# Altium schematic sheet CH32H415REU6-R0.SchDoc
size 457 x 287 mm; SheetNumber: 7; SheetTotal: 7
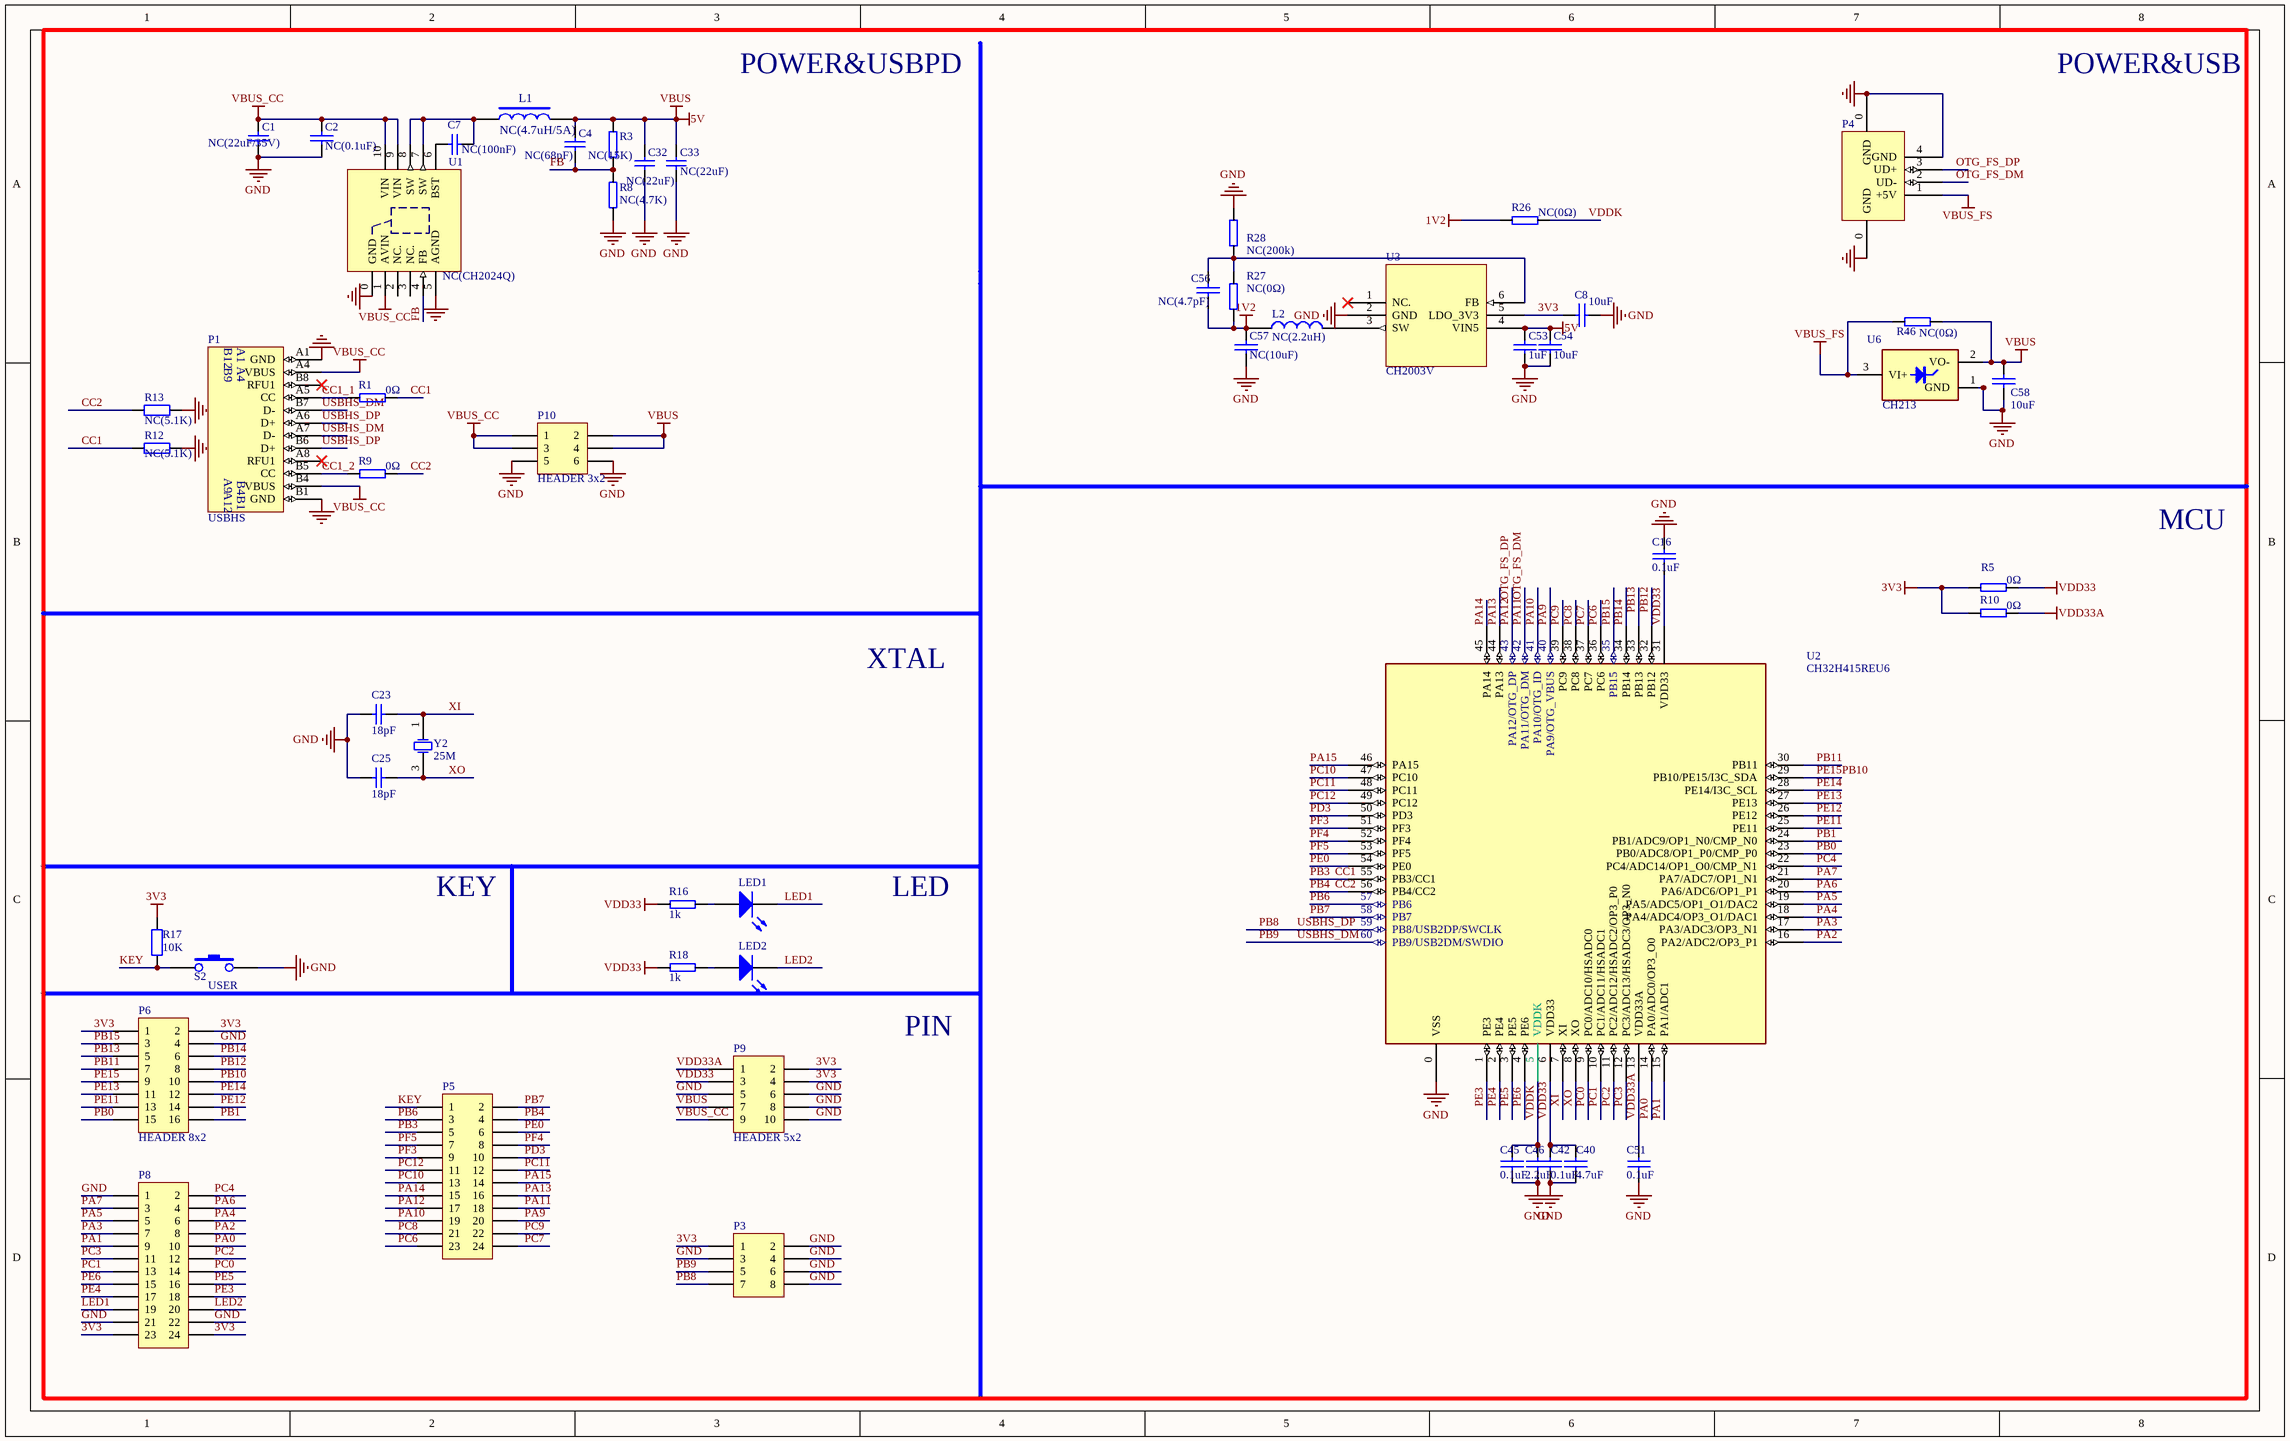
[diagram p0: CH32H415REU6-R0.SchDoc]

## Parts
C1  NC(22uF/35V)  [0805_C]
C2  NC(0.1uF)  [0402_C]
C4  NC(68pF)  [0402_C]
C7  NC(100nF)  [0603_C]
C8  10uF  [0603_C]
C16  0.1uF  [0402_C]
C23  18pF  [0402_C]
C25  18pF  [0402_C]
C32  NC(22uF)  [0805_C]
C33  NC(22uF)  [0805_C]
C40  4.7uF  [0402_C]
C42  0.1uF  [0402_C]
C45  0.1uF  [0402_C]
C46  2.2uF  [0402_C]
C51  0.1uF  [0402_C]
C53  1uF  [0402_C]
C54  10uF  [0603_C]
C56  NC(4.7pF)  [0402_C]
C57  NC(10uF)  [0603_C]
C58  10uF  [0603_C]
L1  NC(4.7uH/5A)  [SMD_6x6mm]
L2  NC(2.2uH)  [CD32]
LED1  LED2  blue  [0603+]  (value not drawn)
LED2  LED1   blue  [0603+]  (value not drawn)
P1  USBHS  [TYPE-C-Receptacle-2.0]
P3  HEADER 4x2  [IDC8-2.54mm]  (value not drawn)
P4  USB_FS  [USBAF]  (value not drawn)
P5  (no value)  [IDC24-2.54MM]
P6  HEADER 8x2  [IDC16-2.54mm]
P8  (no value)  [IDC24-2.54MM]
P9  HEADER 5x2  [IDC10-2.54mm]
P10  HEADER 3x2  [IDC6-2.54mm]
R1  0Ω  [0402]
R3  NC(15K)  [0402]
R5  0Ω  [0402]
R8  NC(4.7K)  [0402]
R9  0Ω  [0402]
R10  0Ω  [0402]
R12  NC(5.1K)  [0402]
R13  NC(5.1K)  [0402]
R16  1k  [0402]
R17  10K  [0402]
R18  1k  [0402]
R26  NC(0Ω)  [0402]
R27  NC(0Ω)  [0402]
R28  NC(200k)  [0402]
R46  NC(0Ω)  [0402]
S2  USER  [SMD_6.1x3.65x2.5mm-KEY]
U1  NC(CH2024Q)  [DFN10_3X3]
U2  CH32H415REU6  [QFN60_6X6]
U3  CH2003V  [SOT-23-6]
U6  CH213  [SOT-23-3]
Y2  25M  [XT3225]

## Nets
1V2: C56.1 C57.2 L2.2 R26.2 R27.1
3V3: C8.2 P3.1 P6.1 P6.2 P8.23 P8.24 P9.2 P9.4 R5.2 R10.2 R17.1 U3.5(LDO_3V3)
GND: C1.1 C2.1 C8.1 C16.2 C23.1 C25.1 C32.1 C33.1 C40.1 C42.1 C45.1 C46.2 C51.1 C53.1 C54.1 C57.1 C58.2 P1.A1(GND) P1.B1(GND) P3.2 P3.3 P3.4 P3.6 P3.8 P4.0(GND) P4.4(GND) P6.4 P8.1 P8.21 P8.22 P9.5 P9.6 P9.8 P9.10 P10.5 P10.6 R8.1 R12.2 R13.2 R28.2 S2.2 U1.0(GND) U1.5(AGND) U2.0(VSS) U3.2(GND) U6.1(GND)
VBUS: C4.1 C32.2 C33.2 C53.2 C54.2 C58.1 L1.2 P9.7 P10.2 P10.4 R3.2 R46.1 U3.4(VIN5) U6.2(VO-)  [also labelled 5V]
VBUS_CC: C1.2 C2.2 P1.A4(VBUS) P1.B4(VBUS) P9.9 P10.1 P10.3 U1.1(AVIN) U1.9(VIN) U1.10(VIN)
VBUS_FS: P4.1(+5V) R46.2 U6.3(VI+)
VDD33: C16.1 C40.2 C42.2 P9.3 R5.1 R16.1 R18.1 U2.6(VDD33) U2.31(VDD33)
VDD33A: C51.2 P9.1 R10.1 U2.13(VDD33A)
CC1: P5.5 R1.1 R12.1 U2.55(PB3/CC1)  [also labelled PB3]
CC1_1: P1.A5(CC) R1.2
CC1_2: P1.B5(CC) R9.2
CC2: P5.4 R9.1 R13.1 U2.56(PB4/CC2)  [also labelled PB4]
FB: C4.2 R3.1 R8.2 U1.4(FB)
KEY: P5.1 R17.2 S2.1
LED1: LED1.2(K) P8.19
LED2: LED2.2(K) P8.20
OTG_FS_DM: P4.2(UD-) P5.18 U2.42(PA11/OTG_DM)  [also labelled PA11]
OTG_FS_DP: P4.3(UD+) P5.17 U2.43(PA12/OTG_DP)  [also labelled PA12]
PA0: P8.10 U2.14(PA0/ADC0/OP3_O0)
PA1: P8.9 U2.15(PA1/ADC1)
PA2: P8.8 U2.16(PA2/ADC2/OP3_P1)
PA3: P8.7 U2.17(PA3/ADC3/OP3_N1)
PA4: P8.6 U2.18(PA4/ADC4/OP3_O1/DAC1)
PA5: P8.5 U2.19(PA5/ADC5/OP1_O1/DAC2)
PA6: P8.4 U2.20(PA6/ADC6/OP1_P1)
PA7: P8.3 U2.21(PA7/ADC7/OP1_N1)
PA9: P5.20 U2.40(PA9/OTG_VBUS)
PA10: P5.19 U2.41(PA10/OTG_ID)
PA13: P5.16 U2.44(PA13)
PA14: P5.15 U2.45(PA14)
PA15: P5.14 U2.46(PA15)
PB0: P6.15 U2.23(PB0/ADC8/OP1_P0/CMP_P0)
PB1: P6.16 U2.24(PB1/ADC9/OP1_N0/CMP_N0)
PB6: P5.3 U2.57(PB6)
PB7: P5.2 U2.58(PB7)
PB8: P1.A6(D+) P1.B6(D+) P3.7 U2.59(PB8/USB2DP/SWCLK)  [also labelled USBHS_DP]
PB9: P1.A7(D-) P1.B7(D-) P3.5 U2.60(PB9/USB2DM/SWDIO)  [also labelled USBHS_DM]
PB10: P6.9 P6.10 U2.29(PB10/PE15/I3C_SDA)  [also labelled PE15]
PB11: P6.7 U2.30(PB11)
PB12: P6.8 U2.32(PB12)
PB13: P6.5 U2.33(PB13)
PB14: P6.6 U2.34(PB14)
PB15: P6.3 U2.35(PB15)
PC0: P8.14 U2.9(PC0/ADC10/HSADC0)
PC1: P8.13 U2.10(PC1/ADC11/HSADC1)
PC2: P8.12 U2.11(PC2/ADC12/HSADC2/OP3_P0)
PC3: P8.11 U2.12(PC3/ADC13/HSADC3/OP3_N0)
PC4: P8.2 U2.22(PC4/ADC14/OP1_O0/CMP_N1)
PC6: P5.23 U2.36(PC6)
PC7: P5.24 U2.37(PC7)
PC8: P5.21 U2.38(PC8)
PC9: P5.22 U2.39(PC9)
PC10: P5.13 U2.47(PC10)
PC11: P5.12 U2.48(PC11)
PC12: P5.11 U2.49(PC12)
PD3: P5.10 U2.50(PD3)
PE0: P5.6 U2.54(PE0)
PE3: P8.18 U2.1(PE3)
PE4: P8.17 U2.2(PE4)
PE5: P8.16 U2.3(PE5)
PE6: P8.15 U2.4(PE6)
PE11: P6.13 U2.25(PE11)
PE12: P6.14 U2.26(PE12)
PE13: P6.11 U2.27(PE13)
PE14: P6.12 U2.28(PE14/I3C_SCL)
PF3: P5.9 U2.51(PF3)
PF4: P5.8 U2.52(PF4)
PF5: P5.7 U2.53(PF5)
VDDK: C45.2 C46.1 R26.1 U2.5(VDDK)
XI: C23.2 U2.7(XI) Y2.1(OSC1)
XO: C25.2 U2.8(XO) Y2.3(OSC2)
NetC7_1: C7.1 U1.6(BST)
NetC7_2: C7.2 L1.1 U1.7(SW) U1.8(SW)
NetC56_2: C56.2 R27.2 R28.1 U3.6(FB)
NetL2_1: L2.1 U3.3(SW)
NetLED1_1: LED1.1(A) R16.2
NetLED2_1: LED2.1(A) R18.2

Not connected (* = marked no-connect by the designer): P1 A8(RFU1)* B8(RFU1)*; U1 2(NC.) 3(NC.); U3 1(NC.)*

## Notes on the sheet
- POWER&USBPD
- POWER&USB
- MCU
- XTAL
- KEY
- LED
- PIN
- Title
- Size:
- Date:
- A3
- Number:
- Time:
- Revision:
- Sheet
- of
- File:
- (in symbol TYPE-C1) B12; B9; A9; A12

## Library data of the parts
C1 C4 C32 C33 = 0603 100nF (104) 10% 50V: 贴片电容; ComponentLink1Description: 供应商链接; ComponentLink1URL: http://www.szlcsc.com/product/details_15331.html; Package: 0603; Supplier: LC; SuppliersPartNumber: C14663
C2 C8 C16 C40 C42 C45 C46 C51 C53 C54 C56-C58 = CAP: Capacitor
C7 = 0603 1uF (105) 10% 50V: 贴片电容; ComponentLink1Description: 供应商链接; ComponentLink1URL: http://www.szlcsc.com/product/details_16531.html; Package: 0603; Supplier: LC; SuppliersPartNumber: C15849
C23 C25 = Cap: Capacitor
L1 L2 = INDUCTOR
LED1 LED2 = LED0: Typical INFRARED GaAs LED; Published: 8-Jun-2000; LatestRevisionDate: 08-Jul-2005; LatestRevisionNote: Mech Layer 1 removed.; PackageReference: LED-0; Publisher: Altium Limited
P1 = TYPE-C1
P3 = HEADER 4x2: Header, 4-Pin, Dual row
P4 = USB: USB Port
P5 P8 = HEADER 12x2: Header, 12-Pin, Dual row
P6 = HEADER 8x2: Header, 8-Pin, Dual row
P9 = HEADER 5x2: Header, 5-Pin, Dual row
P10 = HEADER 3x2: Header, 3-Pin, Dual row
R1 R3 R5 R8-R10 R16 R18 R26-R28 R46 = RES
R12 R13 R17 = Res2: Resistor
S2 = KEY1
U1 = CH2024Q: Step-Down DC-DC Converter, 28V input, FB 1.2V, 3A output
U2 = CH32H415REU6: RISC-V FPU HD-MCU, 400MHz, USB2.0 & PD, OPA, ADC, DAC
U3 = CH2003K: Step-Down DC-DC Converter, 5V input, FB 0.6V, 800mA output, with LDO 3.3V * 200mA
U6 = CH213E: Ideal Diode 5V*1A
Y2 = XTAL: Crystal Oscillator; Published: 8-Jun-2000; LatestRevisionDate: 17-Jul-2002; LatestRevisionNote: Re-released for DXP Platform.; PackageReference: R38; Publisher: Altium Limited